# Altium schematic sheet imx6_boot.SchDoc
size A3; SheetNumber: 3; SheetTotal: 21
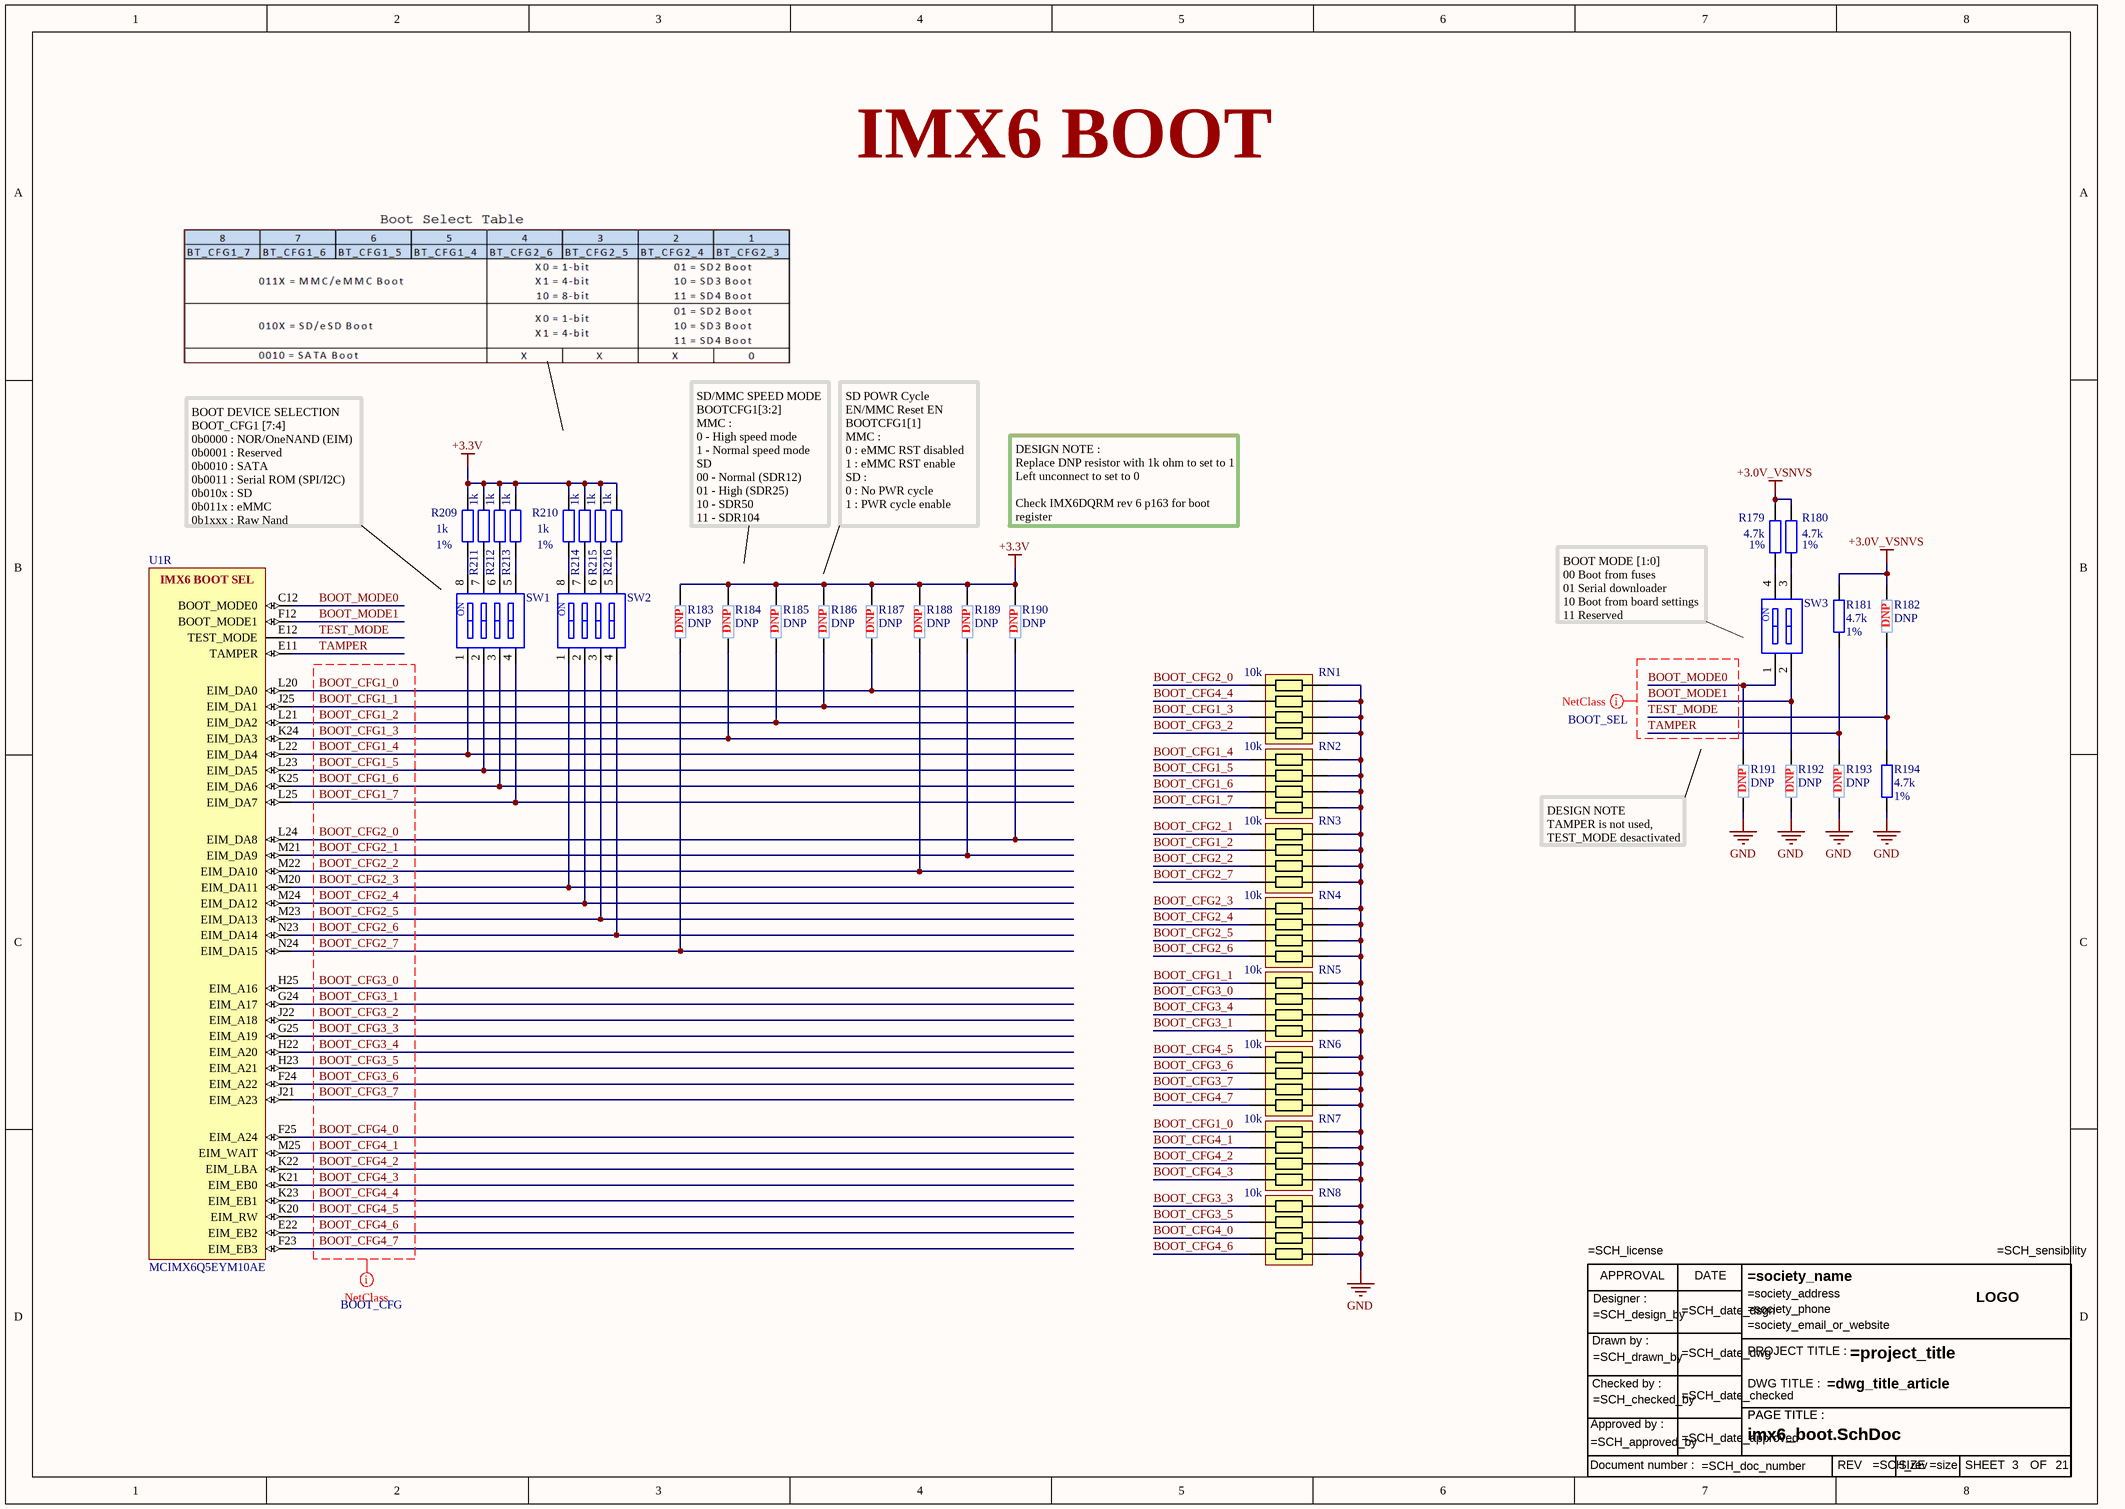
[diagram p0: imx6_boot.SchDoc]

## Parts
R179  4.7k  pourcentage: 1%  [Res 0402/1005]
R180  4.7k  pourcentage: 1%  [Res 0402/1005]
R181  4.7k  pourcentage: 1%  [Res 0402/1005]
R182  DNP  [Res 0402/1005]
R183  DNP  [Res 0402/1005]
R184  DNP  [Res 0402/1005]
R185  DNP  [Res 0402/1005]
R186  DNP  [Res 0402/1005]
R187  DNP  [Res 0402/1005]
R188  DNP  [Res 0402/1005]
R189  DNP  [Res 0402/1005]
R190  DNP  [Res 0402/1005]
R191  DNP  [Res 0402/1005]
R192  DNP  [Res 0402/1005]
R193  DNP  [Res 0402/1005]
R194  4.7k  pourcentage: 1%  [Res 0402/1005]
R209  1k  pourcentage: 1%  [Res 0402/1005]
R210  1k  pourcentage: 1%  [Res 0402/1005]
R211  1k  [Res 0402/1005]
R212  1k  [Res 0402/1005]
R213  1k  [Res 0402/1005]
R214  1k  [Res 0402/1005]
R215  1k  [Res 0402/1005]
R216  1k  [Res 0402/1005]
RN1  10k  [res net x4  EXB-28V103JX]
RN2  10k  [res net x4  EXB-28V103JX]
RN3  10k  [res net x4  EXB-28V103JX]
RN4  10k  [res net x4  EXB-28V103JX]
RN5  10k  [res net x4  EXB-28V103JX]
RN6  10k  [res net x4  EXB-28V103JX]
RN7  10k  [res net x4  EXB-28V103JX]
RN8  10k  [res net x4  EXB-28V103JX]
SW1  416131160804  [DIP SWITCH x4 1.27mm]  (value not drawn)
SW2  416131160804  [DIP SWITCH x4 1.27mm]  (value not drawn)
SW3  416131160802  [DIP switch x2 1.27mm]  (value not drawn)
TB20  Title bloc ANSI modified  (value not drawn)
U1  MCIMX6Q5EYM10AE  [FRES-2197-01]  (part R of 21)

## Nets
+3.0V_VSNVS: R179.2 R180.2 R181.2 R182.2
+3.3V: R183.2 R184.2 R185.2 R186.2 R187.2 R188.2 R189.2 R190.2 R209.2 R210.2 R211.2 R212.2 R213.2 R214.2 R215.2 R216.2
GND: R191.1 R192.1 R193.1 R194.1 RN1.5 RN1.6 RN1.7 RN1.8 RN2.1 RN2.2 RN2.3 RN2.4 RN3.5 RN3.6 RN3.7 RN3.8 RN4.1 RN4.2 RN4.3 RN4.4 RN5.5 RN5.6 RN5.7 RN5.8 RN6.5 RN6.6 RN6.7 RN6.8 RN7.5 RN7.6 RN7.7 RN7.8 RN8.5 RN8.6 RN8.7 RN8.8
BOOT_CFG1_0: R187.1 RN7.1 U1.L20(EIM_DA0)
BOOT_CFG1_1: R186.1 RN5.1 U1.J25(EIM_DA1)
BOOT_CFG1_2: R185.1 RN3.2 U1.L21(EIM_DA2)
BOOT_CFG1_3: R184.1 RN1.3 U1.K24(EIM_DA3)
BOOT_CFG1_4: RN2.8 SW1.1 U1.L22(EIM_DA4)
BOOT_CFG1_5: RN2.7 SW1.2 U1.L23(EIM_DA5)
BOOT_CFG1_6: RN2.6 SW1.3 U1.K25(EIM_DA6)
BOOT_CFG1_7: RN2.5 SW1.4 U1.L25(EIM_DA7)
BOOT_CFG2_0: R190.1 RN1.1 U1.L24(EIM_DA8)
BOOT_CFG2_1: R189.1 RN3.1 U1.M21(EIM_DA9)
BOOT_CFG2_2: R188.1 RN3.3 U1.M22(EIM_DA10)
BOOT_CFG2_3: RN4.8 SW2.1 U1.M20(EIM_DA11)
BOOT_CFG2_4: RN4.7 SW2.2 U1.M24(EIM_DA12)
BOOT_CFG2_5: RN4.6 SW2.3 U1.M23(EIM_DA13)
BOOT_CFG2_6: RN4.5 SW2.4 U1.N23(EIM_DA14)
BOOT_CFG2_7: R183.1 RN3.4 U1.N24(EIM_DA15)
BOOT_CFG3_0: RN5.2 U1.H25(EIM_A16)
BOOT_CFG3_1: RN5.4 U1.G24(EIM_A17)
BOOT_CFG3_2: RN1.4 U1.J22(EIM_A18)
BOOT_CFG3_3: RN8.1 U1.G25(EIM_A19)
BOOT_CFG3_4: RN5.3 U1.H22(EIM_A20)
BOOT_CFG3_5: RN8.2 U1.H23(EIM_A21)
BOOT_CFG3_6: RN6.2 U1.F24(EIM_A22)
BOOT_CFG3_7: RN6.3 U1.J21(EIM_A23)
BOOT_CFG4_0: RN8.3 U1.F25(EIM_A24)
BOOT_CFG4_1: RN7.2 U1.M25(EIM_WAIT)
BOOT_CFG4_2: RN7.3 U1.K22(EIM_LBA)
BOOT_CFG4_3: RN7.4 U1.K21(EIM_EB0)
BOOT_CFG4_4: RN1.2 U1.K23(EIM_EB1)
BOOT_CFG4_5: RN6.1 U1.K20(EIM_RW)
BOOT_CFG4_6: RN8.4 U1.E22(EIM_EB2)
BOOT_CFG4_7: RN6.4 U1.F23(EIM_EB3)
BOOT_MODE0: R191.2 SW3.1 U1.C12(BOOT_MODE0)
BOOT_MODE1: R192.2 SW3.2 U1.F12(BOOT_MODE1)
TAMPER: R181.1 R193.2 U1.E11(TAMPER)
TEST_MODE: R182.1 R194.2 U1.E12(TEST_MODE)
NetR179_1: R179.1 SW3.4
NetR180_1: R180.1 SW3.3
NetR209_1: R209.1 SW1.8
NetR210_1: R210.1 SW2.8
NetR211_1: R211.1 SW1.7
NetR212_1: R212.1 SW1.6
NetR213_1: R213.1 SW1.5
NetR214_1: R214.1 SW2.7
NetR215_1: R215.1 SW2.6
NetR216_1: R216.1 SW2.5

## Layout directives
net class BOOT_CFG: BOOT_CFG1_0, BOOT_CFG1_1, BOOT_CFG1_2, BOOT_CFG1_3, BOOT_CFG1_4, BOOT_CFG1_5, BOOT_CFG1_6, BOOT_CFG1_7, BOOT_CFG2_0, BOOT_CFG2_1, BOOT_CFG2_2, BOOT_CFG2_3, BOOT_CFG2_4, BOOT_CFG2_5, BOOT_CFG2_6, BOOT_CFG2_7, BOOT_CFG3_0, BOOT_CFG3_1, BOOT_CFG3_2, BOOT_CFG3_3, BOOT_CFG3_4, BOOT_CFG3_5, BOOT_CFG3_6, BOOT_CFG3_7, BOOT_CFG4_0, BOOT_CFG4_1, BOOT_CFG4_2, BOOT_CFG4_3, BOOT_CFG4_4, BOOT_CFG4_5, BOOT_CFG4_6, BOOT_CFG4_7
net class BOOT_SEL: BOOT_MODE0, BOOT_MODE1, TAMPER, TEST_MODE

## Notes on the sheet
- IMX6 BOOT
- BOOT DEVICE SELECTION
  BOOT_CFG1 [7:4]
  0b0000 : NOR/OneNAND (EIM)
  0b0001 : Reserved
  0b0010 : SATA
  0b0011 : Serial ROM (SPI/I2C)
  0b010x : SD
  0b011x : eMMC
  0b1xxx : Raw Nand
- SD/MMC SPEED MODE
  BOOTCFG1[3:2]
  MMC :
  0 - High speed mode
  1 - Normal speed mode
  SD
  00 - Normal (SDR12)
  01 - High (SDR25)
  10 - SDR50
  11 - SDR104
- SD POWR Cycle EN/MMC Reset EN
  BOOTCFG1[1]
  MMC :
  0 : eMMC RST disabled
  1 : eMMC RST enable
  SD :
  0 : No PWR cycle
  1 : PWR cycle enable
- DESIGN NOTE :
  Replace DNP resistor with 1k ohm to set to 1
  Left unconnect to set to 0
  Check IMX6DQRM rev 6 p163 for boot register
- BOOT MODE [1:0]
  00 Boot from fuses
  01 Serial downloader
  10 Boot from board settings
  11 Reserved
- DESIGN NOTE
  TAMPER is not used, TEST_MODE desactivated
- (in symbol DIP switch x2) ON
- (in symbol DIP switch x4) ON
- (in symbol IMX6Q5EYM10AE, part R) IMX6 BOOT SEL
- (in symbol Title bloc ANSI) APPROVAL; DATE; Designer :; LOGO; Drawn by :; PROJECT TITLE :; Checked by :; DWG TITLE :; PAGE TITLE :; Approved by :; Document number :; REV; SIZE; SHEET; OF

## Library data of the parts
R179-R181 R194 = res 4.7k 1%: res 4.7k 1% 0402
R182-R193 = res DNP 0402: res DNP 0403; pourcentage: 1%
R209-R216 = res 1k 1%: res 1k 1% 0402
  R211-R216: pourcentage: 1%
RN1-RN8 = res 10k net x4: resistor network 10k 5% x4 EXB-28V103JX
SW1 SW2 = DIP switch x4
SW3 = DIP switch x2
TB20 = Title bloc ANSI
U1 = IMX6Q5EYM10AE: 32-Bit i.MX 6 Quad Application Processor, 1 GHz, 256 KB RAM, Extended Consumer Grade, 624-Pin FCPBGA, RoHS, Tape and Reel; PartNumber: MCIMX6Q5EYM10ACR; Manufacturer: Freescale Semiconductor; CAN: FlexCAN; Number of Cores: 4 Spec; External Memory Supported: DDR3, DDR3L, FLASH, LPDDR2; Speed Grade: 1 GHz; Core Type: ARM Cortex A9; Cache (KB): 32; Ethernet: 1 Gbps + IEEE 1588; Internal RAM (KB): 256; ComponentLink1Description: Manufacturer URL; ComponentLink2Description: Datasheet; DatasheetVersion: Rev. 2.3; ComponentLink3URL: http://cache.freescale.com/files/32bit/doc/data_sheet/IMX6DQCEC.pdf?fpsp=1&WT_TYPE=Data%20Sheets&WT_VENDOR=FREESCALE&WT_FILE_FORMAT=pdf&WT_ASSET=Documentation; ComponentLink1URL: http://www.freescale.com/; Packing: Tape and Reel; Temperature Range: -20 to 105 degC; ComponentLink2URL: http://cache.freescale.com/files/32bit/doc/data_sheet/IMX6DQCEC.pdf?fpsp=1&WT_TYPE=Data%20Sheets&WT_VENDOR=FREESCALE&WT_FILE_FORMAT=pdf&WT_ASSET=Documentation; ComponentLink3Description: Package Specification; PackageVersion: Rev. A; RoHS: TRUE; Quad/Dual CPU: i.MX 6Quad; Mounting Technology: Surface Mount; PackageReference: FCPBGA-624; PackageDescription: 624-pin Ball Grid Array Package, Body 21 x 21mm, Pitch 0.8mm